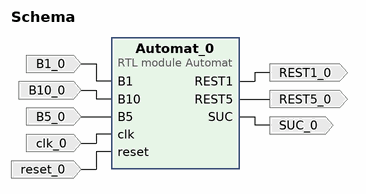
[diagram p0: block diagram of the top level]
# Vivado block design Schema, xc7a100tcsg324-1, Vivado 2020.2
create_bd_design Schema

create_bd_port -dir I B1_0
create_bd_port -dir I B10_0
create_bd_port -dir I B5_0
create_bd_port -dir O REST1_0
create_bd_port -dir O REST5_0
create_bd_port -dir O SUC_0
create_bd_port -dir I -type clk clk_0
create_bd_port -dir I -type rst reset_0

create_bd_cell -type module -reference Automat Automat_0

# ---- connections ----

connect_bd_net -net B1_0_1 [get_bd_ports B1_0] [get_bd_pins Automat_0/B1]
connect_bd_net -net B10_0_1 [get_bd_ports B10_0] [get_bd_pins Automat_0/B10]
connect_bd_net -net B5_0_1 [get_bd_ports B5_0] [get_bd_pins Automat_0/B5]
connect_bd_net [get_bd_pins Automat_0/REST1] [get_bd_ports REST1_0]
connect_bd_net [get_bd_pins Automat_0/REST5] [get_bd_ports REST5_0]
connect_bd_net [get_bd_pins Automat_0/SUC] [get_bd_ports SUC_0]
connect_bd_net -net clk_0_1 [get_bd_ports clk_0] [get_bd_pins Automat_0/clk]
connect_bd_net -net reset_0_1 [get_bd_ports reset_0] [get_bd_pins Automat_0/reset]

validate_bd_design
save_bd_design
